# EAGLE design pinpadv2 (EAGLE 5.10)
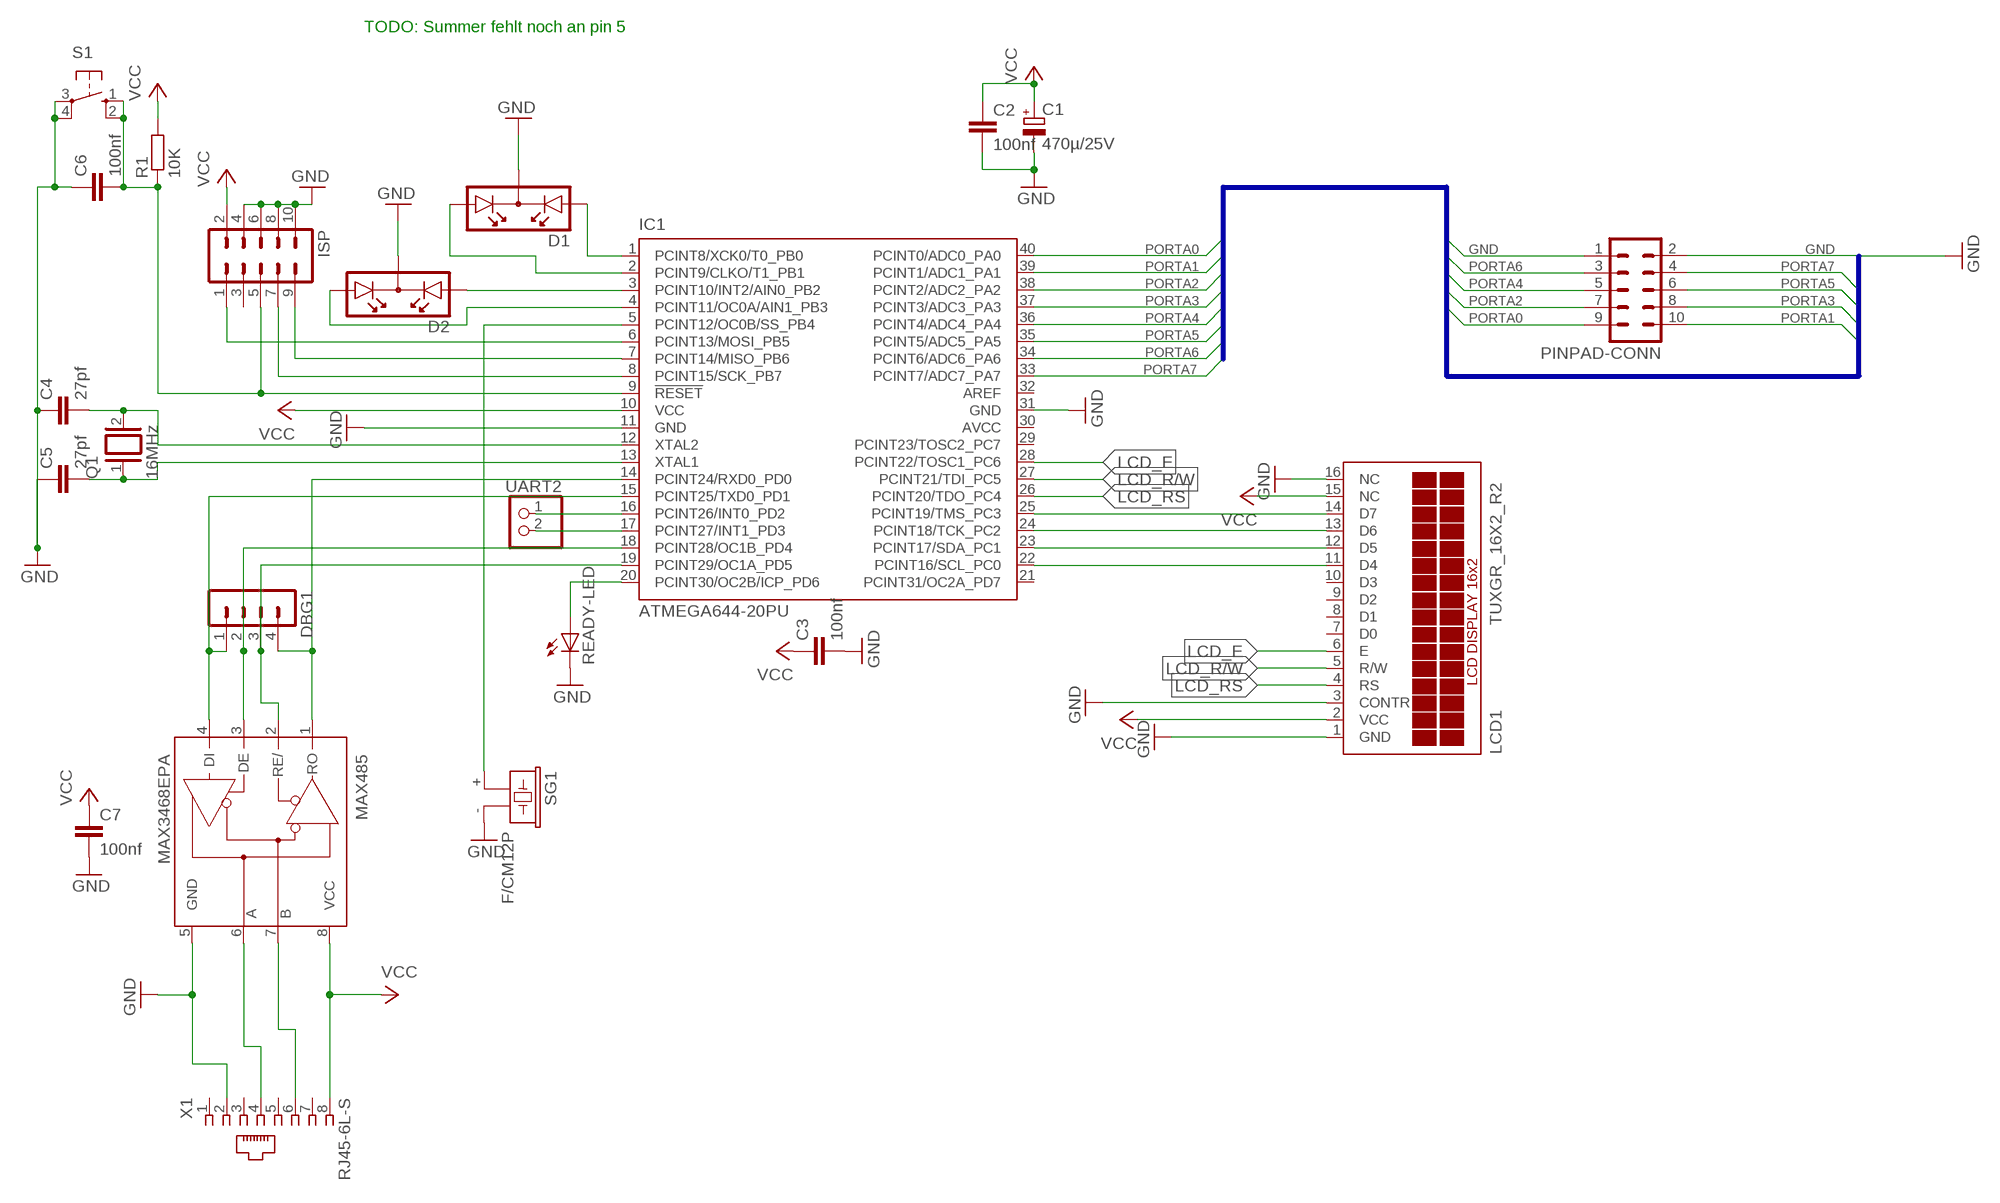
[diagram p0: schematic, sheet 1]

## Parts
C1  470µ/25V  CPOL-EUE3.5-10  [E3,5-10]
C2  100nf  C2,5-3  [C2.5-3]
C3  100nf  C2,5-3  [C2.5-3]
C4  27pf  C2,5-3  [C2.5-3]
C5  27pf  C2,5-3  [C2.5-3]
C6  100nf  C2,5-3  [C2.5-3]
C7  100nf  C2,5-3  [C2.5-3]
D1  DUOLED  [DUOLED]
D2  DUOLED  [DUOLED]
DBG1  MA04-1  [MA04-1]
IC1  ATMEGA644-20PU  [DIL40]
ISP  ML10  [ML10]
LCD1  TUXGR_16X2_R2  [TUXGR_16X2_R2]
MAX485  MAX3468EPA  [DIL08]
PINPAD-CONN  ML10  [ML10]
Q1  16MHz  XTAL/S  [QS]
R1  10K  R-EU_0204/7  [0204/7]
READY-LED  LED5MM  [LED5MM]
S1  10-XX  [B3F-10XX]
SG1  F/CM12P  [F/CM12P]
UART2  PINHD-1X2  [1X02]
X1  RJ45-6L-S  [RJ45-NO-SHIELD]

## Nets
GND: C1.- C2.2 C3.2 C4.1 C5.1 C6.1 C7.2 D1.K D2.K IC1.11(GND) IC1.31(GND) ISP.4 ISP.6 ISP.8 ISP.10 LCD1.1(GND) LCD1.3(CONTR) LCD1.16(NC) MAX485.5(GND) PINPAD-CONN.1 PINPAD-CONN.2 READY-LED.K(C) S1.3(P) S1.4(P1) SG1.- X1.2
LCD_E: IC1.28(PCINT22/TOSC1_PC6) LCD1.6(E)
LCD_R/W: IC1.27(PCINT21/TDI_PC5) LCD1.5(R/W)
LCD_RS: IC1.26(PCINT20/TDO_PC4) LCD1.4(RS)
N$1: MAX485.7(B) X1.6
N$2: DBG1.4 IC1.14(PCINT24/RXD0_PD0) MAX485.1(RO)
N$3: DBG1.1 IC1.15(PCINT25/TXD0_PD1) MAX485.4(DI)
N$4: DBG1.2 IC1.18(PCINT28/OC1B_PD4) MAX485.3(DE)
N$5: IC1.6(PCINT13/MOSI_PB5) ISP.1
N$6: C6.2 IC1.9(!RESET) ISP.5 R1.1 S1.1(S) S1.2(S1)
N$7: IC1.7(PCINT14/MISO_PB6) ISP.9
N$8: D1.A1 IC1.1(PCINT8/XCK0/T0_PB0)
N$9: C4.2 IC1.12(XTAL2) Q1.2
N$10: C5.2 IC1.13(XTAL1) Q1.1
N$11: D1.A2 IC1.2(PCINT9/CLKO/T1_PB1)
N$12: MAX485.6(A) X1.4
N$13: D2.A1 IC1.3(PCINT10/INT2/AIN0_PB2)
N$14: D2.A2 IC1.4(PCINT11/OC0A/AIN1_PB3)
N$15: IC1.22(PCINT16/SCL_PC0) LCD1.11(D4)
N$16: IC1.23(PCINT17/SDA_PC1) LCD1.12(D5)
N$17: IC1.24(PCINT18/TCK_PC2) LCD1.13(D6)
N$18: IC1.8(PCINT15/SCK_PB7) ISP.7
N$19: IC1.25(PCINT19/TMS_PC3) LCD1.14(D7)
N$20: IC1.20(PCINT30/OC2B/ICP_PD6) READY-LED.A
N$21: DBG1.3 IC1.19(PCINT29/OC1A_PD5) MAX485.2(RE/)
N$22: IC1.16(PCINT26/INT0_PD2) UART2.1
N$23: IC1.17(PCINT27/INT1_PD3) UART2.2
N$24: IC1.5(PCINT12/OC0B/SS_PB4) SG1.+
PORTA0: IC1.40(PCINT0/ADC0_PA0) PINPAD-CONN.9
PORTA1: IC1.39(PCINT1/ADC1_PA1) PINPAD-CONN.10
PORTA2: IC1.38(PCINT2/ADC2_PA2) PINPAD-CONN.7
PORTA3: IC1.37(PCINT3/ADC3_PA3) PINPAD-CONN.8
PORTA4: IC1.36(PCINT4/ADC4_PA4) PINPAD-CONN.5
PORTA5: IC1.35(PCINT5/ADC5_PA5) PINPAD-CONN.6
PORTA6: IC1.34(PCINT6/ADC6_PA6) PINPAD-CONN.3
PORTA7: IC1.33(PCINT7/ADC7_PA7) PINPAD-CONN.4
VCC: C1.+ C2.1 C3.1 C7.1 IC1.10(VCC) ISP.2 LCD1.2(VCC) LCD1.15(NC) MAX485.8(VCC) R1.2 X1.8
Unconnected: IC1.21(PCINT31/OC2A_PD7) IC1.29(PCINT23/TOSC2_PC7) IC1.32(AREF) ISP.3 LCD1.7(D0) LCD1.8(D1) LCD1.9(D2) LCD1.10(D3) X1.1 X1.3 X1.5 X1.7

## Buses
PINPAD:PORTA[0..7],GND

## Notes on the sheet
- TODO: Summer fehlt noch an pin 5

## Power pins joined to a net without a drawn wire
AVCC: IC1.30(AVCC)

## Library data of the parts
C1 = rcl:CPOL-EU: POLARIZED CAPACITOR, European symbol
C2-C7 = capacitor-wima:C: CAPACITOR naming: grid - package width
D1 D2 = special:DUOLED: Duo LED
DBG1 = con-lstb:MA04-1: PIN HEADER
IC1 = atmel:ATMEGA644-*PU: 8-bit Microcontroller with 64K Bytes In-System Programmable Flash Auto generated by make-symbol-device-package-bsdl.ulp Rev. 34 Source: http://www.atmel.com/dyn/resources/prod_documents/doc2593.pdf
ISP = con-harting-ml:ML10: HARTING
LCD1 = display-lcd:TUXGR_16X2_R2: Tuxgraphics LCD display 16x2 characters reflective, without background light Source: tuxgr_12x2_r2.pdf; OC_FARNELL: unknown; OC_NEWARK: unknown
MAX485 = maxim:MAX34*: +5V, Fail-Safe, 40Mbps, Profibus RS-485/RS-422 Transceivers Source: MAX3465-MAX3469.pdf
PINPAD-CONN = con-ml:ML10: HARTING; OC_FARNELL: unknown; OC_NEWARK: unknown
Q1 = special:XTAL/S: CRYSTAL
R1 = resistor:R-EU_: RESISTOR, European symbol
READY-LED = led:LED: LED OSRAM: - CHIPLED LG R971, LG N971, LY N971, LG Q971, LY Q971, LO R971, LY R971 LH N974, LH R974 LS Q976, LO Q976, LY Q976 LO Q996 - Hyper CHIPLED LW Q18S LB Q993, LB Q99A, LB R99A - SideLED LS A670, LO A670, LY A670, LG A670, LP A670 LB A673, LV A673, LT A673, LW A673 LH A674 LY A675 LS A676, LA A676, LO A676, LY A676, LW A676 LS A679, LY A679, LG A679 - Hyper Micro SIDELED® LS Y876, LA Y876, LO Y876, LY Y876 LT Y87S - SmartLED LW L88C, LW L88S LB L89C, LB L89S, LG L890 LS L89K, LO L89K, LY L89K LS L896, LA L896, LO L896, LY L896 - TOPLED LS T670, LO T670, LY T670, LG T670, LP T670 LSG T670, LSP T670, LSY T670, LOP T670, LYG T670 LG T671, LOG T671, LSG T671 LB T673, LV T673, LT T673, LW T673 LH T674 LS T676, LA T676, LO T676, LY T676, LB T676, LH T676, LSB T676, LW T676 LB T67C, LV T67C, LT T67C, LS T67K, LO T67K, LY T67K, LW E67C LS E67B, LA E67B, LO E67B, LY E67B, LB E67C, LV E67C, LT E67C LW T67C LS T679, LY T679, LG T679 LS T770, LO T770, LY T770, LG T770, LP T770 LB T773, LV T773, LT T773, LW T773 LH T774 LS E675, LA E675, LY E675, LS T675 LS T776, LA T776, LO T776, LY T776, LB T776 LHGB T686 LT T68C, LB T68C - Hyper Mini TOPLED® LB M676 - Mini TOPLED Santana® LG M470 LS M47K, LO M47K, LY M47K Source: http://www.osram.convergy.de LUXEON: - LUMILED® LXK2-PW12-R00, LXK2-PW12-S00, LXK2-PW14-U00, LXK2-PW14-V00 LXK2-PM12-R00, LXK2-PM12-S00, LXK2-PM14-U00 LXK2-PE12-Q00, LXK2-PE12-R00, LXK2-PE12-S00, LXK2-PE14-T00, LXK2-PE14-U00 LXK2-PB12-K00, LXK2-PB12-L00, LXK2-PB12-M00, LXK2-PB14-N00, LXK2-PB14-P00, LXK2-PB14-Q00 LXK2-PR12-L00, LXK2-PR12-M00, LXK2-PR14-Q00, LXK2-PR14-R00 LXK2-PD12-Q00, LXK2-PD12-R00, LXK2-PD12-S00 LXK2-PH12-R00, LXK2-PH12-S00 LXK2-PL12-P00, LXK2-PL12-Q00, LXK2-PL12-R00 Source: www.luxeon.com KINGBRIGHT: KA-3528ASYC Source: www.kingbright.com
S1 = switch-omron:10-XX: OMRON SWITCH
SG1 = buzzer:F/CM12P: BUZZER Source: Buerklin
UART2 = pinhead:PINHD-1X2: PIN HEADER
X1 = con-tycoelectronics:RJ45: CORCOM Modular RJ Jacks No Shield Source: www.tycoelectronics.com .. ENG_DS_1654001_1099_RJ_L_0507.pdf

## Board
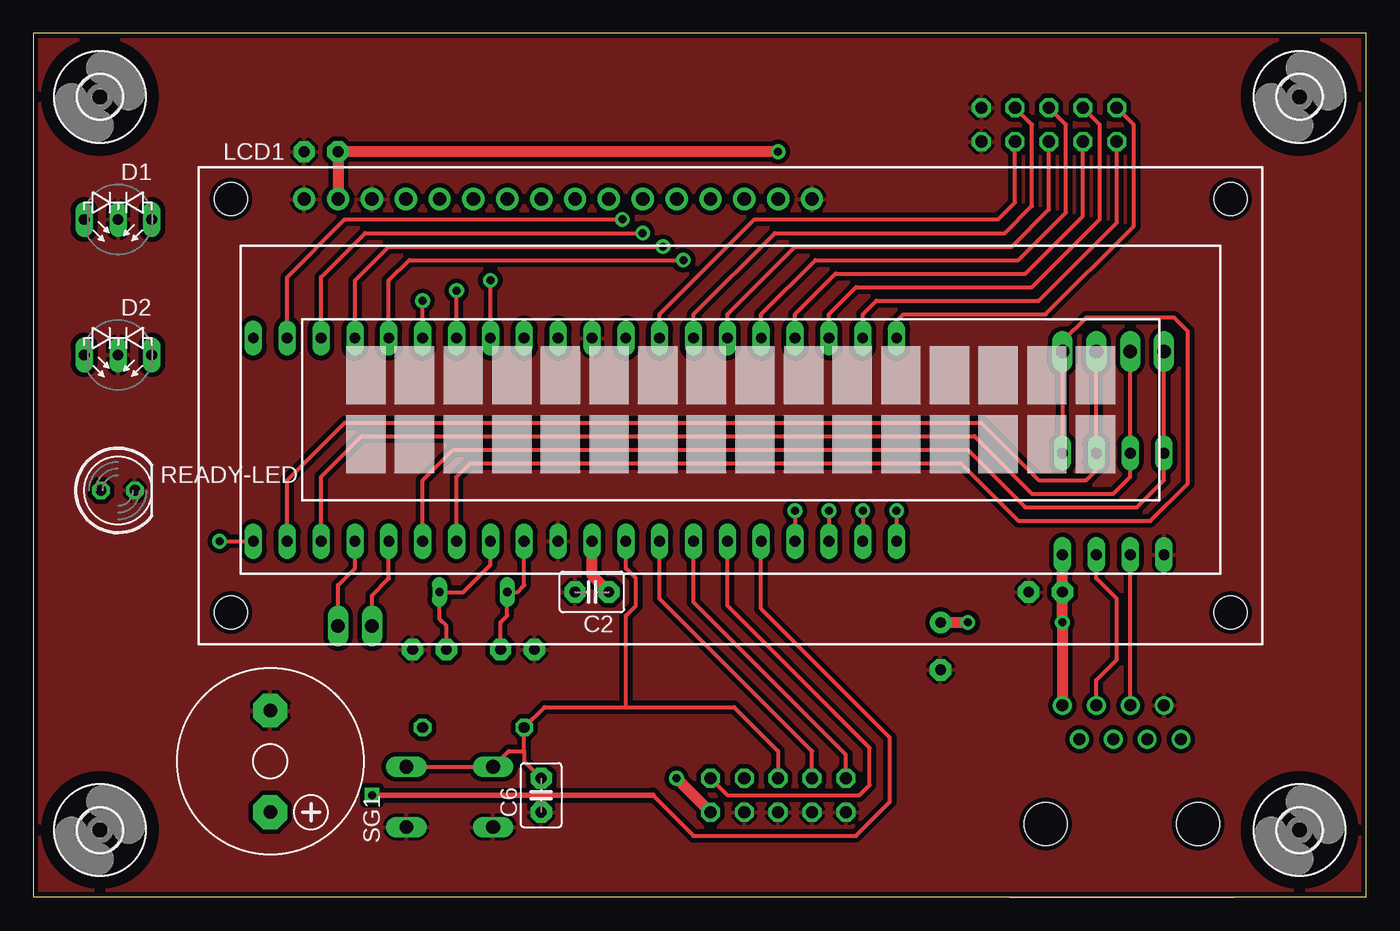
[diagram p1: board, top side]
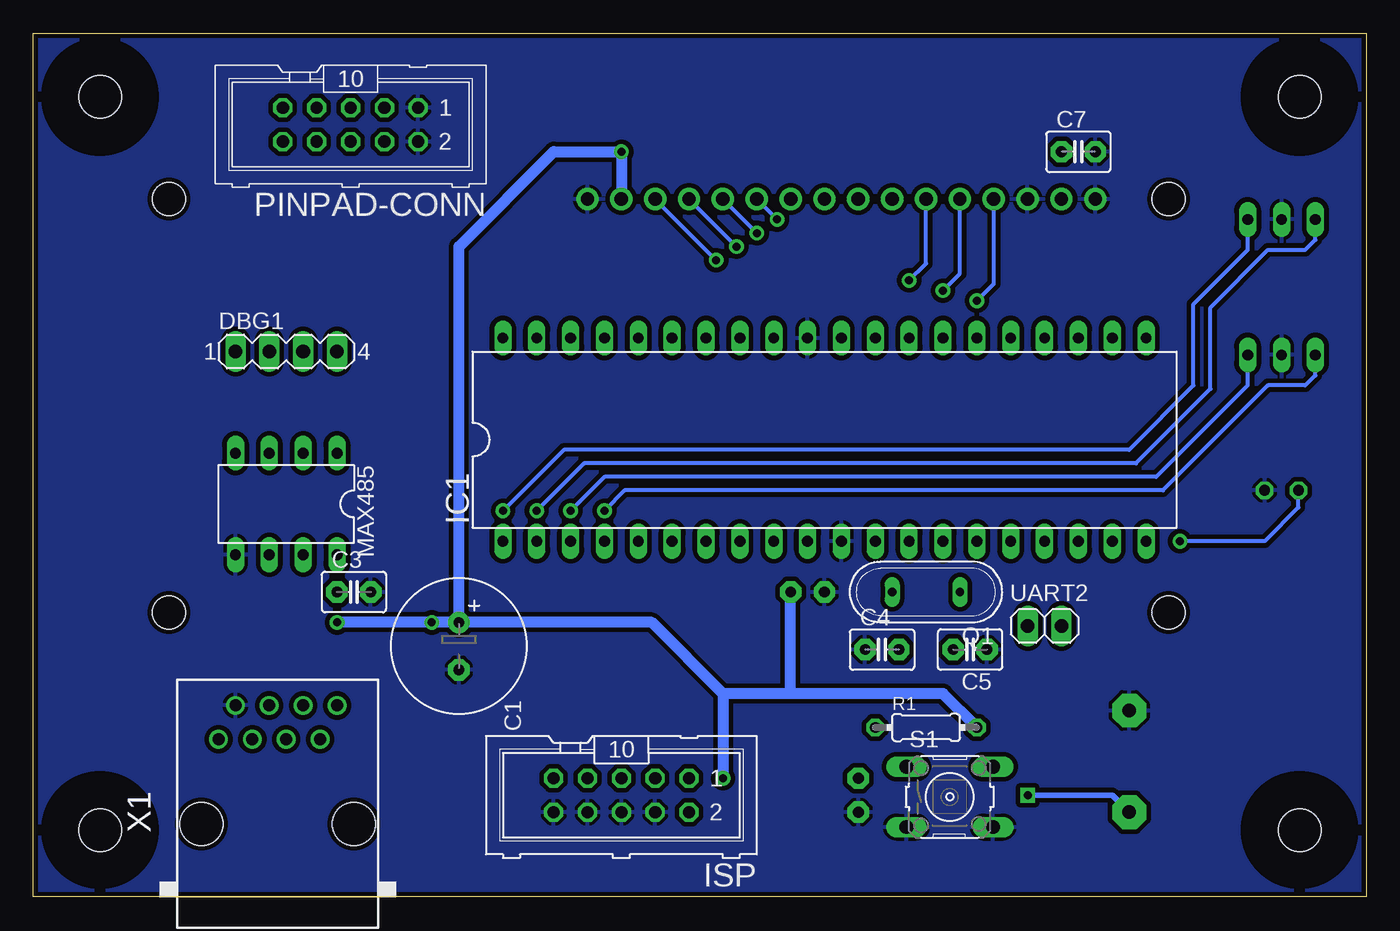
[diagram p2: board, bottom side, seen from below]

Size 100 x 64.81 mm. Coordinates in mm from the lower left corner, seen from the top.
Outline: 0,0.05 100,0.05 100,64.81 0,64.81 0,0.05
Copper layers (1*16): Top 0.035mm / dielectric 1.5mm / Bottom 0.035mm
Design rules "default *": minimum track width 10mil, minimum drill 1mil, track to track 10mil, track to pad 10mil, pad to pad 10mil, via to via 10mil, smd to smd 8mil, copper to edge 8mil, drill to drill 8mil, minimum pad ring 10mil, minimum via ring 10mil, stop-mask expansion 0mil, vias tented up to drill 0mil, thermal gap 10mil

### Footprints (pad centres in the part's own frame; a part is rotated, then mirrored left to right if it is on the bottom)
E3,5-10 = drill 0.813 pad 1.6 round: + -1.778,0 | drill 0.813 pad 1.6 octagon: - 1.778,0
C2.5-3 = drill 0.813 pad 1.6 octagon: 1 -1.27,0; 2 1.27,0
DUOLED = drill 0.813 long: A1 -3.81,0; A2 1.27,0; K -1.27,0
MA04-1 = drill 1.016 long: 1 -3.81,0; 2 -1.27,0; 3 1.27,0; 4 3.81,0
DIL40 = drill 0.813 long: 1 -24.13,-7.62; 2 -21.59,-7.62; 3 -19.05,-7.62; 4 -16.51,-7.62; 5 -13.97,-7.62; 6 -11.43,-7.62; 7 -8.89,-7.62; 8 -6.35,-7.62; 9 -3.81,-7.62; 10 -1.27,-7.62; 11 1.27,-7.62; 12 3.81,-7.62; 13 6.35,-7.62; 14 8.89,-7.62; 15 11.43,-7.62; 16 13.97,-7.62; 17 16.51,-7.62; 18 19.05,-7.62; 19 21.59,-7.62; 20 24.13,-7.62; 21 24.13,7.62; 22 21.59,7.62; 23 19.05,7.62; 24 16.51,7.62; 25 13.97,7.62; 26 11.43,7.62; 27 8.89,7.62; 28 6.35,7.62; 29 3.81,7.62; 30 1.27,7.62; 31 -1.27,7.62; 32 -3.81,7.62; 33 -6.35,7.62; 34 -8.89,7.62; 35 -11.43,7.62; 36 -13.97,7.62; 37 -16.51,7.62; 38 -19.05,7.62; 39 -21.59,7.62; 40 -24.13,7.62
ML10 = drill 0.914 octagon: 1 -5.08,-1.27; 2 -5.08,1.27; 3 -2.54,-1.27; 4 -2.54,1.27; 5 0,-1.27; 6 0,1.27; 7 2.54,-1.27; 8 2.54,1.27; 9 5.08,-1.27; 10 5.08,1.27
TUXGR_16X2_R2 = drill 1 pad 1.676 round: 1 -32,15.5; 2 -29.46,15.5; 3 -26.92,15.5; 4 -24.38,15.5; 5 -21.84,15.5; 6 -19.3,15.5; 7 -16.76,15.5; 8 -14.22,15.5; 9 -11.68,15.5; 10 -9.14,15.5; 11 -6.6,15.5; 12 -4.06,15.5; 13 -1.52,15.5; 14 1.02,15.5; 15 3.56,15.5; 16 6.1,15.5 | hole 2.5: -37.5,-15.5; 37.5,-15.5; -37.5,15.5; 37.5,15.5
DIL08 = drill 0.813 long: 1 -3.81,-3.81; 2 -1.27,-3.81; 3 1.27,-3.81; 4 3.81,-3.81; 5 3.81,3.81; 6 1.27,3.81; 7 -1.27,3.81; 8 -3.81,3.81
QS = drill 0.61 long: 1 -2.54,0; 2 2.54,0
0204/7 = drill 0.813 octagon: 1 -3.81,0; 2 3.81,0
LED5MM = drill 0.813 octagon: A -1.27,0; K 1.27,0
B3F-10XX = drill 1.016 long: 1 -3.251,2.261; 2 3.251,2.261; 3 -3.251,-2.261; 4 3.251,-2.261
F/CM12P = drill 1.016 pad 2.54 octagon: + 3.81,0; - -3.81,0
3,2 = hole 3.2: 0,0
1X02 = drill 1.016 long: 1 -1.27,0; 2 1.27,0
RJ45-NO-SHIELD = drill 0.9 pad 1.4 round: 1 -4.445,6.35; 2 -3.175,8.89; 3 -1.905,6.35; 4 -0.635,8.89; 5 0.635,6.35; 6 1.905,8.89; 7 3.175,6.35; 8 4.445,8.89 | hole 3.251: -5.715,0; 5.715,0

### Placement (x,y rotation side)
C1  68.07,18.85 270 bottom
C2  41.91,22.91 180 top
C3  75.95,22.91 0 bottom
C4  36.32,18.59 0 bottom
C5  29.72,18.59 180 bottom
C6  38.1,7.67 90 top
C7  21.59,55.93 0 bottom
D1  5.08,50.85 180 top
D2  5.08,40.69 180 top
DBG1  81.03,40.94 0 bottom
IC1  40.64,34.34 0 bottom
ISP  55.88,7.67 180 bottom
LCD1  52.32,36.88 0 top
MAX485  81.03,29.51 180 bottom
PINPAD-CONN  76.2,57.96 180 bottom
Q1  33.02,22.91 180 bottom
R1  33.02,12.75 0 bottom
READY-LED  6.35,30.53 0 top
S1  31.24,7.54 0 bottom
SG1  17.78,10.21 270 top
U$1  [3,2]  5,60.05 0 top
U$2  [3,2]  95,60.05 0 top
U$3  [3,2]  95,5.05 0 top
U$4  [3,2]  5,5.05 0 top
UART2  24.13,20.37 0 bottom
X1  81.66,5.51 0 bottom

### Tracks (layer width: path | path; a pad name or v marks a point on that pad's centre or on a via)
GND
  pour Bottom (isolate 0.35): 0,64.82 0,0.05 99.82,0.05 99.82,64.82 0.25,64.82
  pour Top (isolate 0.35): 0,64.82 0,0.05 99.82,0.05 99.82,64.82 0.25,64.82
LCD_E  (via drill 0.6)
  Top 0.305: IC1.28 v34.29,46.28
  Bottom 0.305: LCD1.6 33.02,47.54 v34.29,46.28
LCD_R/W  (via drill 0.6)
  Top 0.305: IC1.27 v31.75,45.52
  Bottom 0.305: LCD1.5 30.48,46.78 v31.75,45.52
LCD_RS  (via drill 0.6)
  Top 0.305: IC1.26 v29.21,44.75
  Bottom 0.305: LCD1.4 27.94,46.02 v29.21,44.75
N$1
  Top 0.305: X1.6 79.76,16.31 81.28,17.83 81.28,22.4 79.76,23.93 MAX485.7
N$2
  Top 0.305: MAX485.1 DBG1.4 77.22,41.71 78.99,43.48 85.6,43.48 86.61,42.47 86.61,31.04 83.82,28.24 73.91,28.24 69.6,32.56 32.77,32.56 31.75,31.55 IC1.14
N$3
  Top 0.305: DBG1.1 MAX485.4 84.84,31.29 82.8,29.26 74.42,29.26 70.1,33.58 31.5,33.58 29.21,31.29 IC1.15
N$4
  Top 0.305: DBG1.2 MAX485.3 82.3,31.55 81.03,30.28 74.93,30.28 70.61,34.59 24.64,34.59 21.59,31.55 IC1.18
N$5
  Top 0.305: IC1.6 52.07,21.89 62.74,11.23 62.74,8.43 61.98,7.67 52.07,7.67 ISP.1
N$6
  Top 0.305: 36.83,10.97 35.66,10.97 S1.1 S1.2 | 36.83,10.97 R1.1 38.35,14.27 44.45,14.27 | C6.2 36.83,10.21 36.83,10.97 | 44.45,14.27 44.45,21.13 45.21,21.89 45.21,23.93 44.45,24.69 IC1.9 | ISP.5 55.88,10.97 52.58,14.27 44.45,14.27
N$7
  Top 0.305: IC1.7 49.53,22.15 60.96,10.72 ISP.9
N$8  (via drill 0.6)
  Top 0.305: v64.77,29.01 IC1.1
  Bottom 0.305: v64.77,29.01 60.2,33.58 17.78,33.58 12.95,38.4 12.95,44.5 8.89,48.56 D1.A1
N$9
  Top 0.305: IC1.12 36.83,23.42 36.32,22.91 Q1.2 35.56,21.13 35.05,20.62 C4.2
N$10
  Top 0.305: C5.2 30.99,20.37 30.48,20.88 Q1.1 32.26,22.91 34.29,24.94 IC1.13
N$11  (via drill 0.6)
  Top 0.305: v62.23,29.01 IC1.2
  Bottom 0.305: v62.23,29.01 58.67,32.56 17.27,32.56 11.68,38.15 11.68,44.25 7.37,48.56 4.57,48.56 3.81,49.33 D1.A2
N$12
  Top 0.305: X1.4 MAX485.6
N$13  (via drill 0.6)
  Top 0.305: v59.69,29.01 IC1.3
  Bottom 0.305: v59.69,29.01 57.15,31.55 15.75,31.55 8.89,38.4 D2.A1
N$14  (via drill 0.6)
  Top 0.305: v57.15,29.01 IC1.4
  Bottom 0.305: v57.15,29.01 55.63,30.53 15.24,30.53 7.37,38.4 4.57,38.4 3.81,39.17 D2.A2
N$15  (via drill 0.6)
  Top 0.305: v44.19,50.85 23.37,50.85 19.05,46.53 IC1.22
  Bottom 0.305: v44.19,50.85 LCD1.11
N$16  (via drill 0.6)
  Top 0.305: v45.72,49.83 24.89,49.83 21.59,46.53 IC1.23
  Bottom 0.305: v45.72,49.83 LCD1.12
N$17  (via drill 0.6)
  Top 0.305: v47.24,48.82 26.67,48.82 24.13,46.28 IC1.24
  Bottom 0.305: v47.24,48.82 LCD1.13
N$18
  Top 0.305: IC1.8 46.99,22.4 58.42,10.97 ISP.7
N$19  (via drill 0.6)
  Top 0.305: v48.77,47.8 28.19,47.8 26.67,46.28 IC1.25
  Bottom 0.305: v48.77,47.8 LCD1.14
N$20  (via drill 0.6)
  Top 0.305: v13.97,26.72 IC1.20
  Bottom 0.305: v13.97,26.72 7.62,26.72 5.08,29.26 READY-LED.A
N$21
  Top 0.305: DBG1.3 MAX485.2 79.76,32.05 78.99,31.29 75.44,31.29 71.12,35.61 23.37,35.61 19.05,31.29 IC1.19
N$22
  Top 0.305: IC1.16 26.67,23.93 25.4,22.66 UART2.1
N$23
  Top 0.305: UART2.2 22.86,23.42 24.13,24.69 IC1.17
N$24  (via drill 0.6)
  Top 0.305: 46.48,7.67 49.53,4.62 61.72,4.62 64.26,7.16 64.26,11.99 54.61,21.64 IC1.5
  Top 0.406: v25.4,7.67 46.48,7.67
  Bottom 0.406: SG1.+ 19.05,7.67 v25.4,7.67
PORTA0
  Top 0.305: IC1.40 64.77,43.23 65.28,43.74 75.95,43.74 82.55,50.34 82.55,57.96 PINPAD-CONN.9
PORTA1
  Top 0.305: IC1.39 62.23,43.74 63.25,44.75 75.44,44.75 81.28,50.6 PINPAD-CONN.10
PORTA2
  Top 0.305: IC1.38 59.69,43.74 61.72,45.77 74.93,45.77 80.01,50.85 80.01,57.96 PINPAD-CONN.7
PORTA3
  Top 0.305: IC1.37 57.15,43.74 60.2,46.79 74.42,46.79 78.74,51.1 PINPAD-CONN.8
PORTA4
  Top 0.305: IC1.36 54.61,43.74 58.67,47.8 73.91,47.8 77.47,51.36 77.47,57.96 PINPAD-CONN.5
PORTA5
  Top 0.305: IC1.35 52.07,43.74 57.15,48.82 73.41,48.82 76.2,51.61 PINPAD-CONN.6
PORTA6
  Top 0.305: IC1.34 49.53,43.74 55.63,49.83 72.9,49.83 74.93,51.87 74.93,57.96 PINPAD-CONN.3
PORTA7
  Top 0.305: IC1.33 46.99,43.74 54.1,50.85 72.39,50.85 73.66,52.12 PINPAD-CONN.4
VCC  (via drill 0.6)
  Top 0.813: X1.8 v77.22,20.62 C3.1 MAX485.8 | v48.26,8.94 ISP.2 | IC1.10 41.91,24.18 C2.1 | v55.88,55.93 C7.1 LCD1.2 | C1.+ v70.1,20.62
  Bottom 0.813: 48.26,15.29 53.59,20.62 C1.+ | 43.18,15.29 31.75,15.29 R1.2 | 43.18,15.29 48.26,15.29 | 48.26,15.29 v48.26,8.94 | 43.18,15.29 C2.1 | C1.+ v70.1,20.62 v77.22,20.62 | C1.+ 68.07,48.82 60.96,55.93 v55.88,55.93 55.88,55.68 LCD1.15 | LCD1.2
  other vias: 22.86,52.38